# Altium schematic sheet Display.SchDoc
size A4
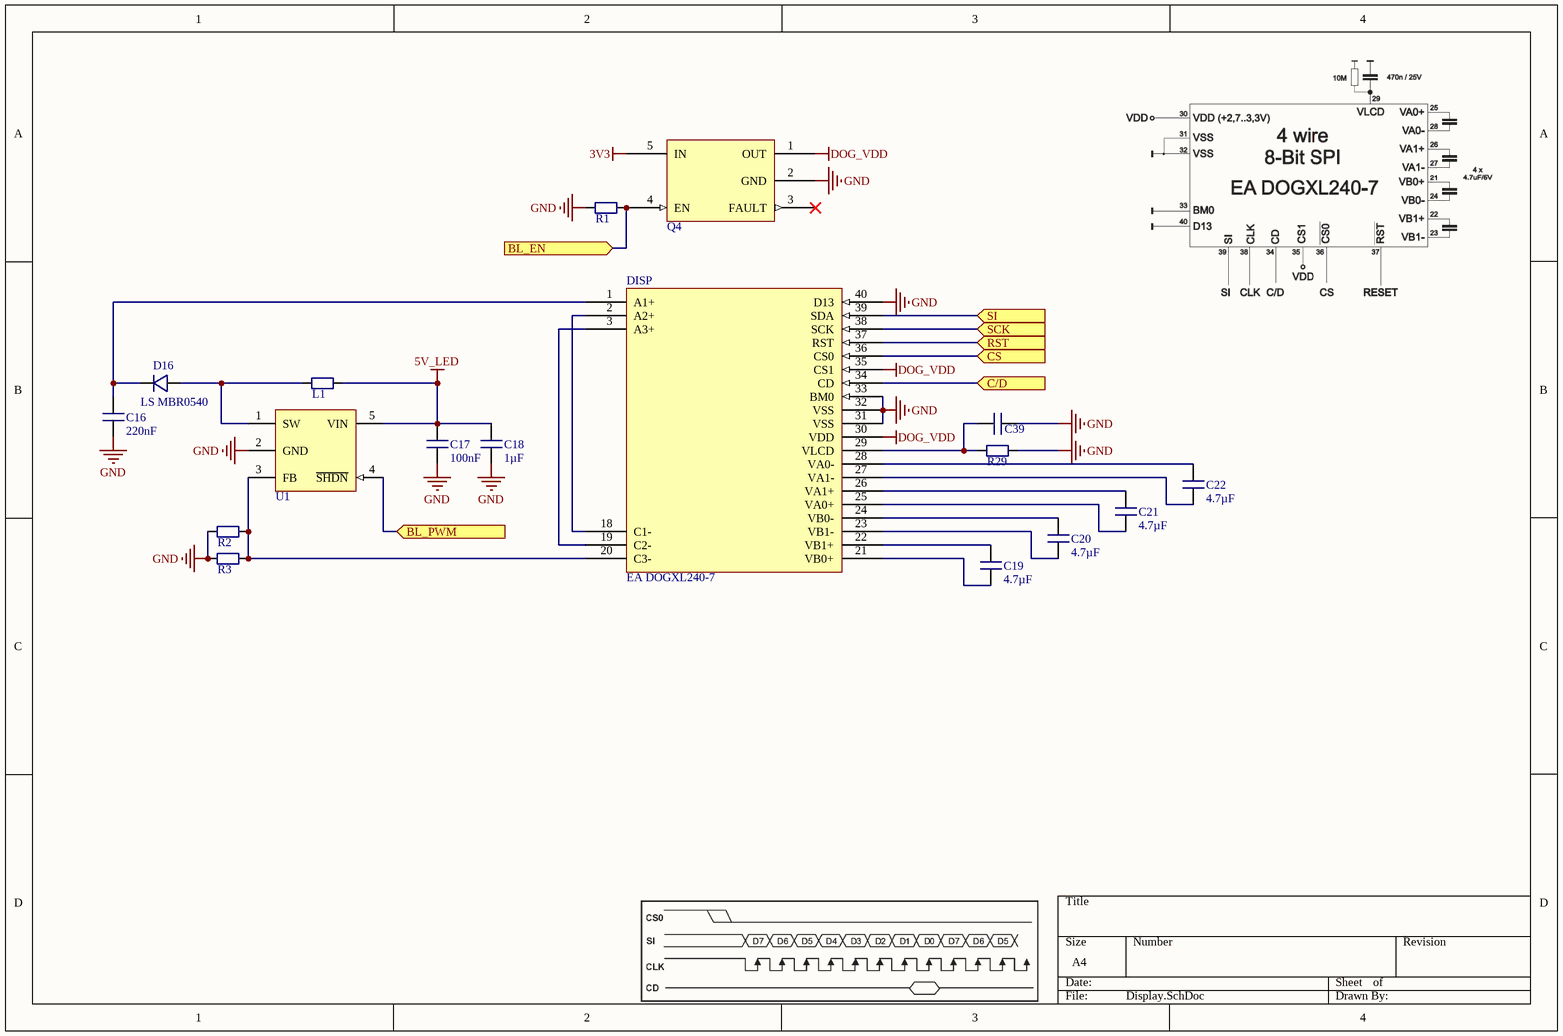
[diagram p0: Display.SchDoc]

## Parts
C16  220nF  [C0805H085_L]
C17  100nF  [C0603H08_M]
C18  1µF  [C0603H08_M]
C19  4.7µF  [C0603H08_L]
C20  4.7µF  [C0603H08_L]
C21  4.7µF  [C0603H08_L]
C22  4.7µF  [C0603H08_L]
C39  TO BE DEFINED!  [C0805H06_M]  (value not drawn)
D16  LS MBR0540  [SOD123_H]
DISP  EA DOGXL240-7  [DOGXL240*-7 + LED]
L1  .Resistor  [R0805H05_M]  (value not drawn)
Q4  Enhanced single channel power switches  [SOT-23-5]  (value not drawn)
R1  .Resistor  [R0603H05_M]  (value not drawn)
R2  .Resistor  [R0805H05_M]  (value not drawn)
R3  .Resistor  [R0805H05_M]  (value not drawn)
R29  .Resistor  [R0603H05_M]  (value not drawn)
U1  CAT4238  [SOT-23-5]  (value not drawn)

## Ports
BL_EN (in), BL_PWM (in), C/D (in), CS (in), RST (in), SCK (in), SI (in)

## Nets
3V3: Q4.5(IN)
5V_LED: C17.1 C18.1 L1.2 U1.5(VIN)
DOG_VDD: DISP.30(VDD) DISP.35(CS1) Q4.1(OUT)
GND: C16.1 C17.2 C18.2 C39.2 DISP.31(VSS) DISP.32(VSS) DISP.33(BM0) DISP.40(D13) Q4.2(GND) R1.1 R2.1 R3.1 R29.2 U1.2(GND)
BL_EN: Q4.4(EN) R1.2 ; port BL_EN
BL_PWM: U1.4(~{SHDN}) ; port BL_PWM
C/D: DISP.34(CD) ; port C/D
CS: DISP.36(CS0) ; port CS
RST: DISP.37(RST) ; port RST
SCK: DISP.38(SCK) ; port SCK
SI: DISP.39(SDA) ; port SI
NetC16_2: C16.2 D16.1 DISP.1(A1+)
NetC19_1: C19.1 DISP.22(VB1+)
NetC19_2: C19.2 DISP.21(VB0+)
NetC20_1: C20.1 DISP.24(VB0-)
NetC20_2: C20.2 DISP.23(VB1-)
NetC21_1: C21.1 DISP.26(VA1+)
NetC21_2: C21.2 DISP.25(VA0+)
NetC22_1: C22.1 DISP.28(VA0-)
NetC22_2: C22.2 DISP.27(VA1-)
NetC39_1: C39.1 DISP.29(VLCD) R29.1
NetD16_2: D16.2 L1.1 U1.1(SW)
NetDISP_2: DISP.2(A2+) DISP.18(C1-)
NetDISP_3: DISP.3(A3+) DISP.19(C2-)
NetDISP_20: DISP.20(C3-) R2.2 R3.2 U1.3(FB)

Not connected (* = marked no-connect by the designer): Q4 3(FAULT)*

## Library data of the parts
C16 = C 220nF 50V 0805 MLCC  Y5V: Form: 0805 [M 2012]; Tolerance: +80%, -20%; Farnell Order Number: 1759269; Price: 0.0252; Series: V5Y; Voltage Rating: 50V; Temperature Range: -30°C to +85°C; Value: 220nF
C17 = C 100nF 100V 0603 MLCC X7R: Form: 0603 [M 1608]; Temperature Coeffizient: 0ppm/°C +- 30ppm/°C; Tolerance: +-10%; Price: 0.044; Series: X7R; Voltage Rating: 100V; Temperature Range: -55°C to +125°C; Value: 100nF
C18 = C 1µF 6.3V 0603 MLCC X7R: Form: 0603 [M 1608]; Tolerance: +-10%; Farnell Order Number: 1865556; Price: 0.028; Series: X7R; Voltage Rating: 6.3V; Temperature Range: -55°C to +125°C; Temperature Coeffizient: N/A; Farnell: http://de.farnell.com/kemet/c0603c105k9ractu/kondensator-x7r-0603-6-3v-1uf/dp/1865556; Value: 1µF
C19-C22 = C 4.7µF 6.3V 0603 MLCC X5R: Form: 0603 [M 1608]; Tolerance: +-10%; Farnell Order Number: 2496930; Price: 0.045; Series: X5R; Voltage Rating: 6.3V; Temperature Range: -55°C to +85°C; Value: 4.7µF
C39 = _C 0805
D16 = LS MBR0540: Schottky Rectifier, 500mA, 40V
DISP = EA DOGXL240-7: 240x128
Q4 = HSS STMPS2151 High Side Switch 500mA (2151)/1000mA (2161): Farnell: http://de.farnell.com/stmicroelectronics/stmps2161str/power-switch-1ch-1000ma-sot23-5/dp/1842615; Farnell Order Number: 1842615; Price: 0,651
U1 = STU CAT4238: High Efficiency 10 LED  Boost Converter